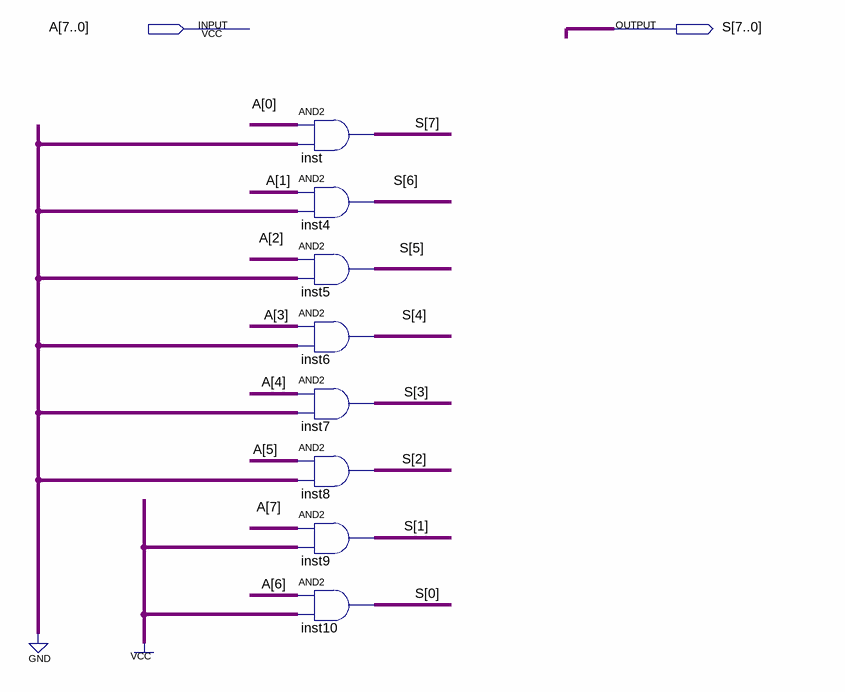
[diagram p0: schematic sheet]
// Quartus schematic g27_6bit_shift_right_matthew.bdf as structural Verilog: 8 symbols, 2 pins
module g27_6bit_shift_right_matthew (
  input  [7:0] A,
  output [7:0] S
);

  and inst (S[7], A[0], 1'b0);
  and inst4 (S[6], A[1], 1'b0);
  and inst5 (S[5], A[2], 1'b0);
  and inst6 (S[4], A[3], 1'b0);
  and inst7 (S[3], A[4], 1'b0);
  and inst8 (S[2], A[5], 1'b0);
  and inst9 (S[1], A[7], 1'b1);
  and inst10 (S[0], A[6], 1'b1);
endmodule
